# Altium schematic sheet Sheet3-USB.SchDoc
size A3; SheetNumber: 3; SheetTotal: 3
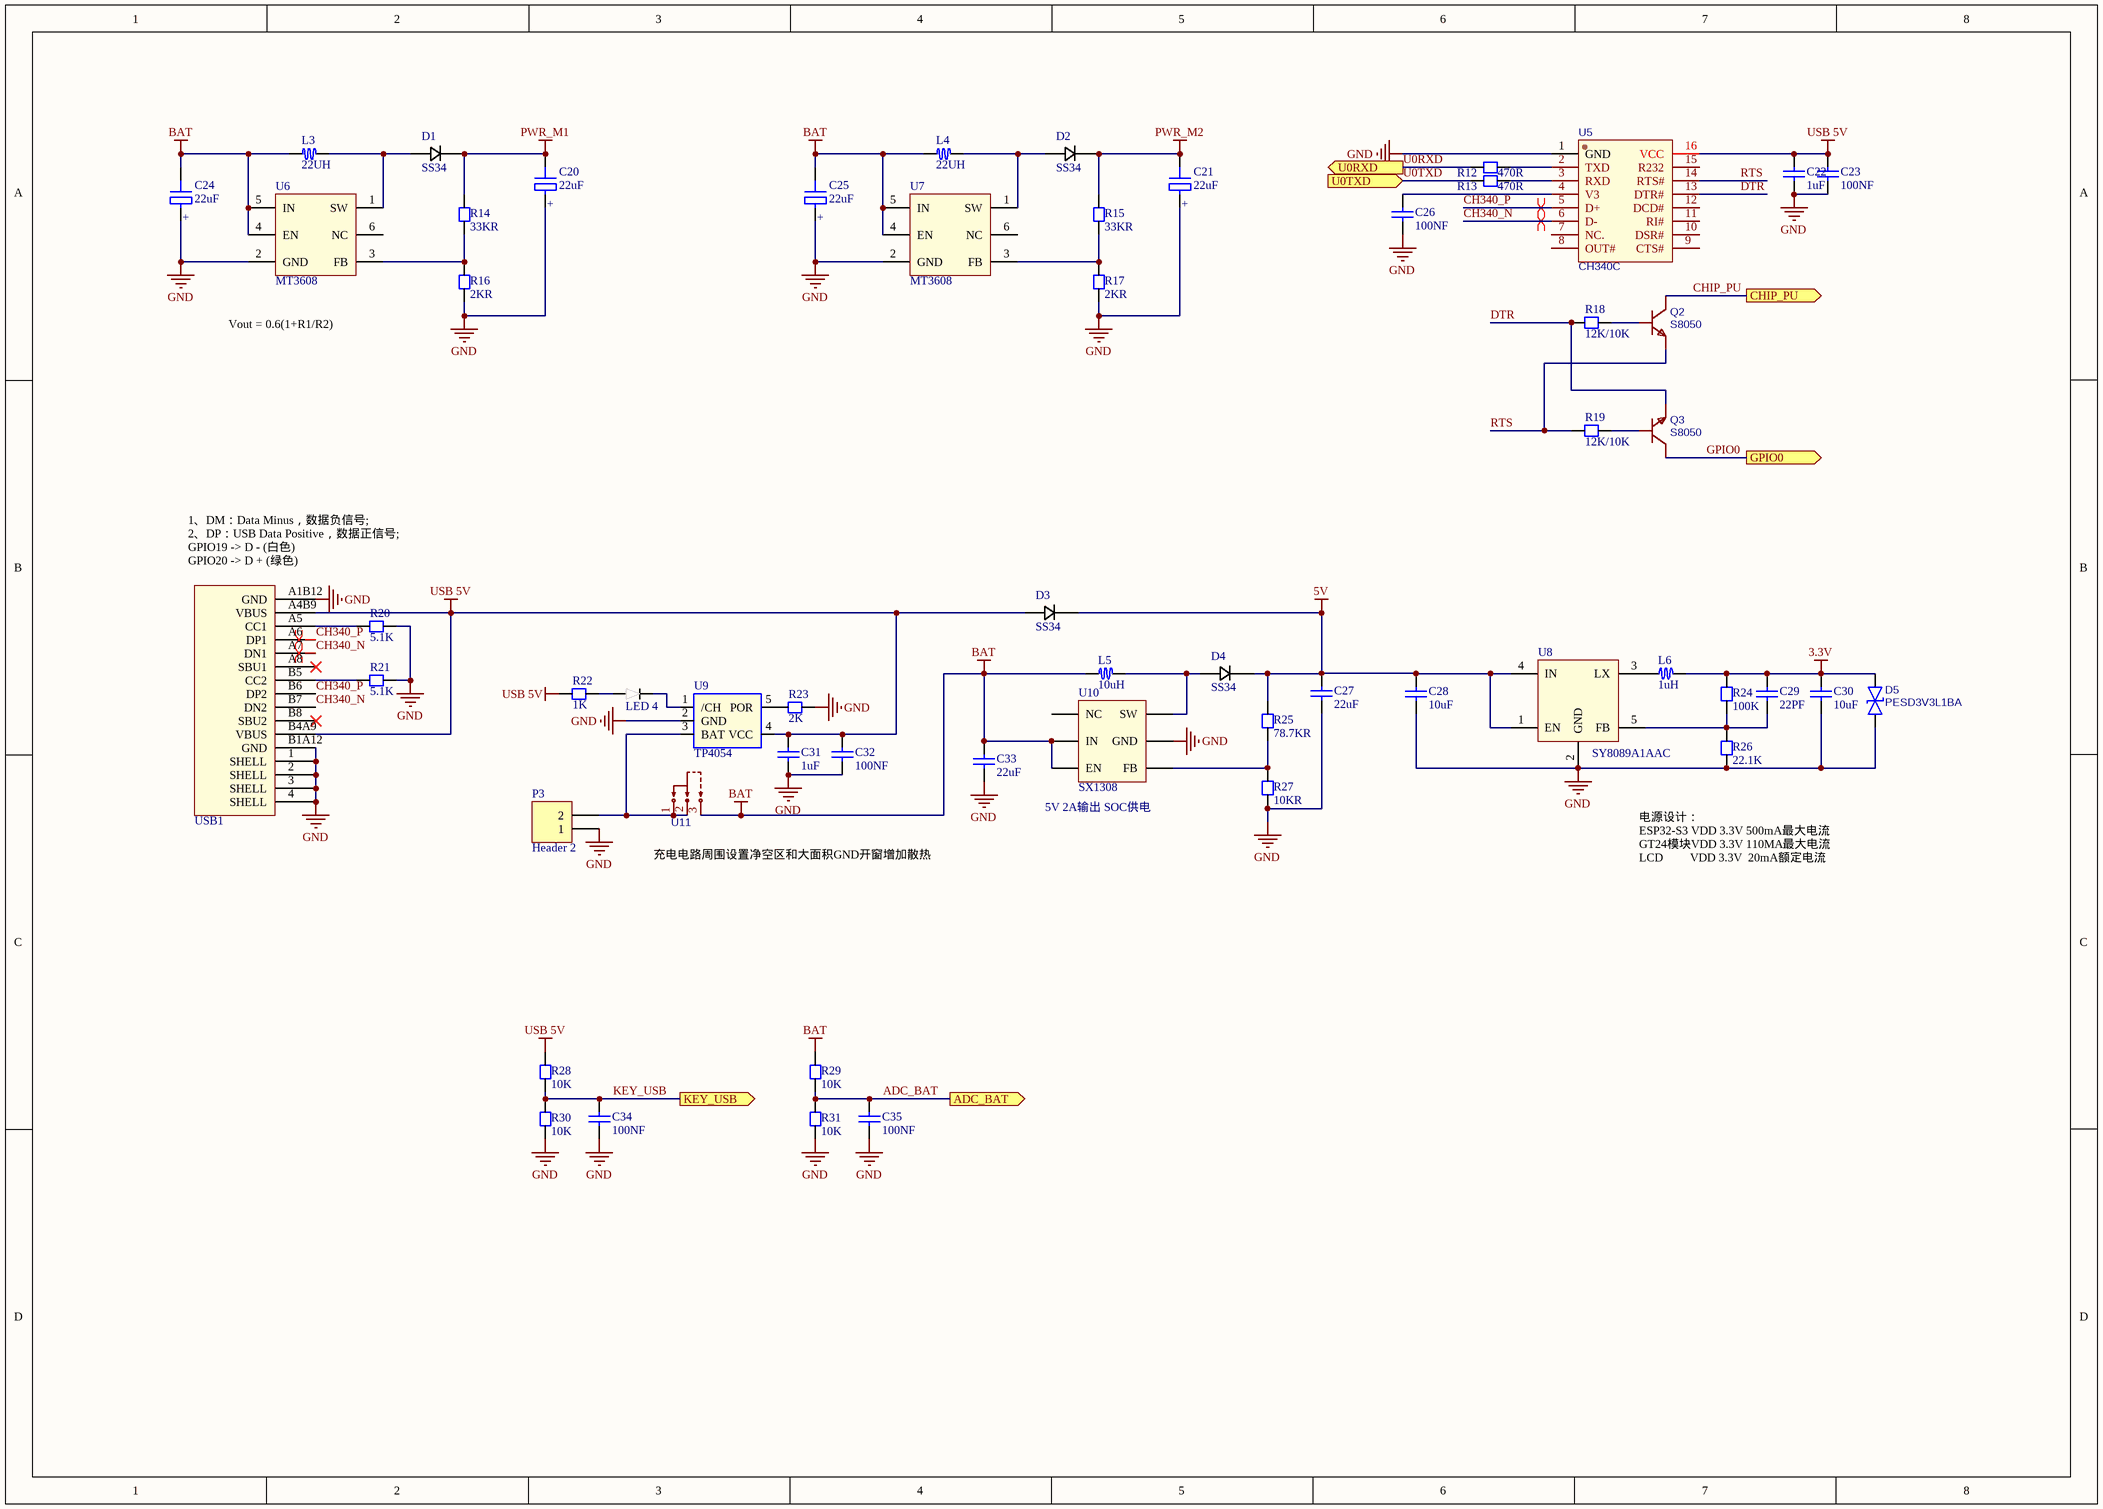
[diagram p0: Sheet3-USB.SchDoc]

## Parts
C20  22uF  [TAN-A-1206]
C21  22uF  [TAN-A-1206]
C22  1uF  [CC1608-0603]
C23  100NF  [CC1608-0603]
C24  22uF  [TAN-A-1206]
C25  22uF  [TAN-A-1206]
C26  100NF  [CC1608-0603]
C27  22uF  [CC1608-0603]
C28  10uF  [CC1608-0603]
C29  22PF  [CC1608-0603]
C30  10uF  [CC1608-0603]
C31  1uF  [CC1608-0603]
C32  100NF  [CC1608-0603]
C33  22uF  [CC1608-0603]
C34  100NF  [CC1608-0603]
C35  100NF  [CC1608-0603]
D1  SS34  [DO-214 AA]
D2  SS34  [DO-214 AA]
D3  SS34  [DO-214 AA]
D4  SS34  [DO-214 AA]
D5  PESD3V3L1BA  [SOD-323]
L3  22UH  [CDRH104R]
L4  22UH  [CDRH104R]
L5  10uH  [Inductor-6045]
L6  1uH  [Inductor-4018]
LED_4  LED 0603  [LED 0603]  (value not drawn)
P3  Header 2  [HX2.54-2]
Q2  S8050  [SOT-23]
Q3  S8050  [SOT-23]
R12  470R  [CR1608-0603]
R13  470R  [CR1608-0603]
R14  33KR  [CR1608-0603]
R15  33KR  [CR1608-0603]
R16  2KR  [CR1608-0603]
R17  2KR  [CR1608-0603]
R18  12K/10K  [CR1608-0603]
R19  12K/10K  [CR1608-0603]
R20  5.1K  [CR1608-0603]
R21  5.1K  [CR1608-0603]
R22  1K  [CR1608-0603]
R23  2K  [CR1608-0603]
R24  100K  [CR1608-0603]
R25  78.7KR  [CR1608-0603]
R26  22.1K  [CR1608-0603]
R27  10KR  [CR1608-0603]
R28  10K  [CR1608-0603]
R29  10K  [CR1608-0603]
R30  10K  [CR1608-0603]
R31  10K  [CR1608-0603]
U5  CH340C  [SOP-16]
U6  MT3608  [SOT23-6]
U7  MT3608  [SOT23-6]
U8  SY8089A1AAC  [SOT23-5]
U9  TP4054  [SOT23-5]
U10  SX1308  [SOT23-6]
U11  HX SS12D10G4  [SW-TH_3P-SS12D06]  (value not drawn)
USB1  Tpye-c 16P  [TYPE-C 16P]  (value not drawn)

## Ports
ADC_BAT (out), CHIP_PU (out), GPIO0 (out), KEY_USB (out), U0RXD (out), U0TXD (in)

## Nets
3.3V: C29.2 C30.2 D5.1 L6.2 R24.1
5V: C27.1 C28.2 D3.1(K) D4.1(K) R25.2 U8.1(EN) U8.4(IN)
BAT: C24.2(-) C25.2(-) C33.2 L3.1 L4.1 L5.1 R29.2 U6.4(EN) U6.5(IN) U7.4(EN) U7.5(IN) U10.4(EN) U10.5(IN) U11.3
GND: C20.1(+) C21.1(+) C22.1 C23.1 C24.1(+) C25.1(+) C26.1 C27.2 C28.1 C30.1 C31.1 C32.1 C33.1 C34.1 C35.1 D5.2 P3.1 R16.2 R17.2 R20.1 R21.1 R23.2 R26.2 R27.1 R30.1 R31.1 U5.1(GND) U6.2(GND) U7.2(GND) U8.2(GND) U9.2(GND) U10.2(GND) USB1.1(SHELL) USB1.2(SHELL) USB1.3(SHELL) USB1.4(SHELL) USB1.A1B12(GND) USB1.B1A12(GND)
PWR_M1: C20.2(-) D1.1(K) R14.1
PWR_M2: C21.2(-) D2.1(K) R15.1
USB 5V: C22.2 C23.2 C31.2 C32.2 D3.2(A) R22.1 R28.2 U5.16(VCC) U9.4(VCC) USB1.A4B9(VBUS) USB1.B4A9(VBUS)
ADC_BAT: C35.2 R29.1 R31.2 ; port ADC_BAT
CH340_N: U5.6(D-) USB1.A7(DN1) USB1.B7(DN2)
CH340_P: U5.5(D+) USB1.A6(DP1) USB1.B6(DP2)
CHIP_PU: Q2.3(C) ; port CHIP_PU
DTR: Q3.2(E) R18.1 U5.13(DTR#)
GPIO0: Q3.3(C) ; port GPIO0
KEY_USB: C34.2 R28.1 R30.2 ; port KEY_USB
RTS: Q2.2(E) R19.1 U5.14(RTS#)
U0RXD: R12.2 ; port U0RXD
U0TXD: R13.2 ; port U0TXD
NetC26_2: C26.2 U5.4(V3)
NetC29_1: C29.1 R24.2 R26.1 U8.5(FB)
NetD1_2: D1.2(A) L3.2 U6.1(SW)
NetD2_2: D2.2(A) L4.2 U7.1(SW)
NetD4_2: D4.2(A) L5.2 U10.1(SW)
NetL6_1: L6.1 U8.3(LX)
NetLED_4_1: LED_4.1 R22.2
NetLED_4_2: LED_4.2 U9.1(/CH)
NetP3_2: P3.2 U9.3(BAT) U11.1 U11.2
NetQ2_1: Q2.1(B) R18.2
NetQ3_1: Q3.1(B) R19.2
NetR12_1: R12.1 U5.2(TXD)
NetR13_1: R13.1 U5.3(RXD)
NetR14_2: R14.2 R16.1 U6.3(FB)
NetR15_2: R15.2 R17.1 U7.3(FB)
NetR20_2: R20.2 USB1.A5(CC1)
NetR21_2: R21.2 USB1.B5(CC2)
NetR23_1: R23.1 U9.5(POR)
NetR25_1: R25.1 R27.2 U10.3(FB)

Not connected (* = marked no-connect by the designer): U5 7(NC.) 8(OUT#) 9(CTS#) 10(DSR#) 11(RI#) 12(DCD#) 15(R232); U6 6(NC); U7 6(NC); U10 6(NC); USB1 A8(SBU1)* B8(SBU2)*

## Layout directives
differential pair: CH340_N, CH340_P

## Notes on the sheet
- Vout = 0.6(1+R1/R2)
- (near USB1) 1、DM：Data Minus，数据负信号;
  2、DP：USB Data Positive，数据正信号;
  GPIO19 -> D - (白色)
  GPIO20 -> D + (绿色)
- (near U11) 充电电路周围设置净空区和大面积GND开窗增加散热
- (near U10) 5V 2A输出 SOC供电
- 电源设计：
  ESP32-S3 VDD 3.3V 500mA最大电流
  GT24模块VDD 3.3V 110MA最大电流
  LCD         VDD 3.3V  20mA额定电流

## Library data of the parts
C20 C21 C24 C25 = CAP TAN-A-1206: 钽电容
C22 C23 C26 C28-C35 = Cap Chip 0603: 0603封装的电容; Published: 8-Jun-2000; Revision: July-2002: Re-released for DXP Platform.; Publisher: Altium Limited
C27 = Chip capacitor: 贴片电容
D1-D4 = SS34: 肖特基二极管
D5 = PESD3V3L1BA: SOD-323 3.3V 双向ESD防静电二极管保护芯片; Manufacturer: MDD; Manufacturer Part: SMAJ6.5CA; Supplier: LCSC; Supplier Part: C110041; JLCPCB Part Class: Extended Part; spicePre: D; spiceSymbolName: SMAJ6.5CA-C110041
L3 L4 = Inductor-CDRH104R: 贴片电感 CDRH104R 封装
L5 = Inductor-6045: 6045封装 线绕SMD功率电感
L6 = Inductor-4018: 贴片电感 1206封装
P3 = Header 2: Header, 2-Pin; LatestRevisionDate: 17-Jul-2002; LatestRevisionNote: Re-released for DXP Platform.; Publisher: Altium Limited
Q2 Q3 = S8050: Manufacturer: SALLTECH(萨瑞); Contributor: lcsc; Supplier: LCSC; Supplier Part: C3027096; Manufacturer Part: S8050; spicePre: Q; spiceSymbolName: S8050_C3027096
R12 R13 R18-R24 R26 R28-R31 = Resistor Chip 0603: 0603封装电阻; Published: 8-Jun-2000; Revision: July-2002: Re-released for DXP Platform.; Publisher: Altium Limited
R14-R17 R25 R27 = Chip resistor: 贴片电阻
U5 = CH340C: Manufacturer: WCH(南京沁恒); Supplier: LCSC; Manufacturer Part: CH340C; Supplier Part: C84681; JLCPCB Part Class: Extended Part; spicePre: U; spiceSymbolName: CH340C
U6 U7 = MT3608: • 2V to 24V Input Voltage / • 1.2MHz Fixed Switching Frequency / • Internal 4A Switch Current Limit / • Adjustable Output Voltage / • Internal Compensation / • Up to 28V Output VoltagE
U8 = SY8089A1AAC: SY8089A1是一种高效率的1.5MHz同步降压DC/DC稳压器，能够提供高达输出电流2A。它可以在2.5V到5.5V的宽输入电压范围内工作，集成了主开关和同步开关，具有极低的RDS(ON)，最大限度地减少了导通损耗。 / 输出电压纹波小，外接电感小，电容器尺寸小 / 1.5MHz开关频率。
U9 = TP4054: 迷你充电IC SOT-23-5
U10 = SX1308: SOT23-6 升压芯片
U11 = SW-TH_3P-SS12D06: BOM_Manufacturer: hanxia(韩下); Contributor: lcsc; BOM_Supplier: LCSC; BOM_Supplier Part: C5149841; BOM_Manufacturer Part: HX SS12D10G4; link: https://atta.szlcsc.com/upload/public/pdf/source/20220907/2020D7183ED16DD6E2B9F5A13FB144CF.pdf; BOM_JLCPCB Part Class: Extended Part; spicePre: U; spiceSymbolName: HX SS12D10G4
USB1 = Tpye-c 16P: 16P 封装的TYPE -c接口 4固定插脚 双向